# EAGLE design rx ok (EAGLE 9.6.2)
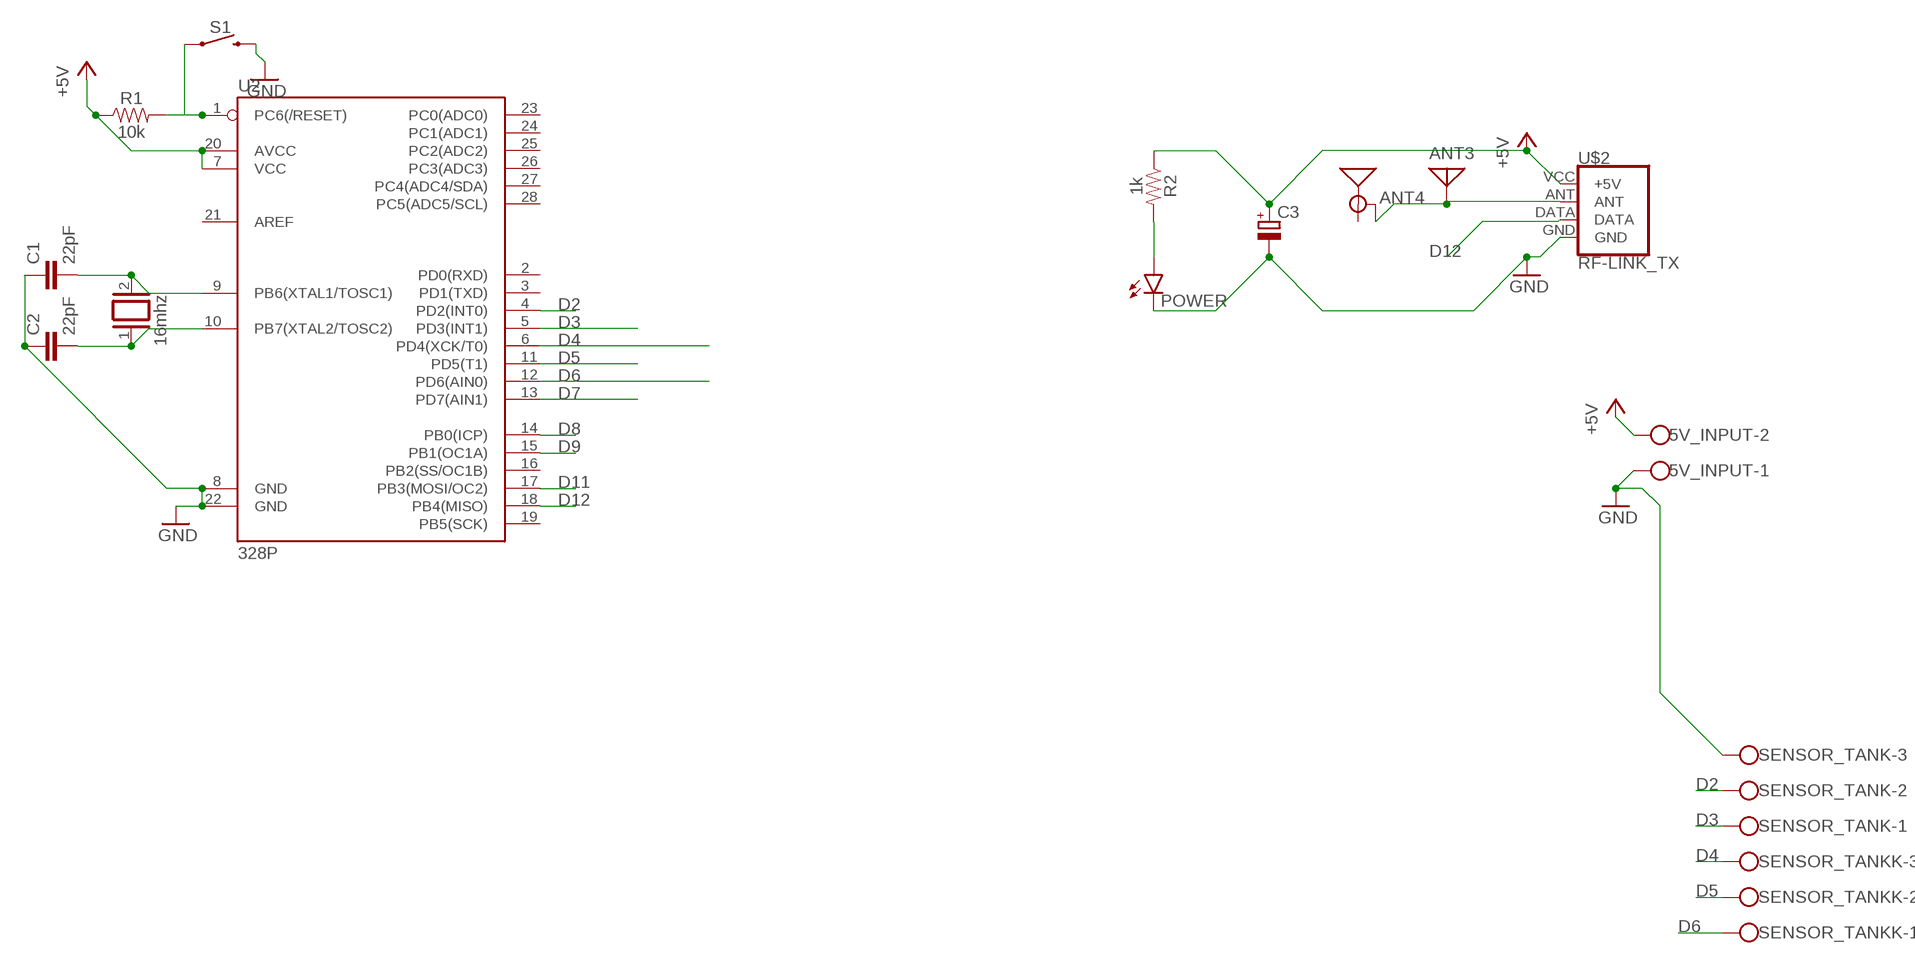
[diagram p0: schematic, sheet 1]

## Parts
5V_INPUT  W237-102  [W237-102]
ANT3  ANTENNA  [PAD-01]
ANT4  ANTENNA-GROUNDEDTRACE-15.2MM  [TRACE_ANTENNA_2.4GHZ_15.2MM]
C1  22pF  22PF-PTH-2.54MM-200V-5%  [CAP-PTH-2.54]
C2  22pF  22PF-PTH-2.54MM-200V-5%  [CAP-PTH-2.54]
C3  C-POL_RADIAL-20MM-DIA  [CAPPRD550W60D1200H2000B]
POWER  LED3MM  [LED3MM]
Q1  16mhz  XTAL/S  [QS]
R1  10k  1KOHM-HORIZ-1/4W-5%  [AXIAL-0.3]
R2  1k  1KOHM-HORIZ-1/4W-1%  [AXIAL-0.3]
S1  MOMENTARY-SWITCH-SPST-PTH-6.0MM  [TACTILE_SWITCH_PTH_6.0MM]
SENSOR_TANK  W237-103  [W237-103]
SENSOR_TANKK  W237-103  [W237-103]
U2  328P  ATMEGA328P_PDIP  [DIP28]
U$2  RF-LINK_TX  [RF-LINK_TX]

## Nets
+5V: 5V_INPUT.2 C3.1(+) R1.P$1 R2.P$1 U2.7(VCC) U2.20(AVCC) U$2.VCC(+5V)
D2: SENSOR_TANK.2 U2.4(PD2(INT0))
D3: SENSOR_TANK.1 U2.5(PD3(INT1))
D4: SENSOR_TANKK.3 U2.6(PD4(XCK/T0))
D5: SENSOR_TANKK.2 U2.11(PD5(T1))
D6: SENSOR_TANKK.1 U2.12(PD6(AIN0))
D7: U2.13(PD7(AIN1))
D8: U2.14(PB0(ICP))
D9: U2.15(PB1(OC1A))
D11: U2.17(PB3(MOSI/OC2))
D12: U2.18(PB4(MISO)) U$2.DATA
GND: 5V_INPUT.1 C1.1 C2.1 C3.2(-) POWER.K(C) S1.3 SENSOR_TANK.3 U2.8(GND) U2.22(GND) U$2.GND
N$1: R1.P$2 S1.1 U2.1(PC6(/RESET))
N$2: C1.2 Q1.2 U2.9(PB6(XTAL1/TOSC1))
N$3: C2.2 Q1.1 U2.10(PB7(XTAL2/TOSC2))
N$5: ANT3.1 ANT4.GND U$2.ANT
N$11: POWER.A R2.P$2
Unconnected: ANT4.ANT(SIGNAL) U2.2(PD0(RXD)) U2.3(PD1(TXD)) U2.16(PB2(SS/OC1B)) U2.19(PB5(SCK)) U2.21(AREF) U2.23(PC0(ADC0)) U2.24(PC1(ADC1)) U2.25(PC2(ADC2)) U2.26(PC3(ADC3)) U2.27(PC4(ADC4/SDA)) U2.28(PC5(ADC5/SCL))

## Library data of the parts
5V_INPUT = con-wago-500:W237-102: WAGO SCREW CLAMP; MPN: 237-102; OC_FARNELL: unknown; OC_NEWARK: 70K9898
ANT3 = discrete:ANTENNA: Antenna
ANT4 = SparkFun-RF:ANTENNA-GROUNDED: Antenna w/ Ground Connection 2.4GHz antennae with signal and ground terminals. TRACE_ANTENNA_2.4GHZ_15.2MM - Meander Trace antenna 15.2 x 5.7mm footprint Based on layout from TI app note AN043 <http://www.ti.com/lit/an/swra117d/swra117d.pdf>. TRACE_ANTENNA_2.4GHZ_25.7MM - Inverted F trace antenna 25.7 x 7.5 mm footprint. Based on layout from TI design note DN0007 <http://www.ti.com/lit/an/swru120b/swru120b.pdf>.
C1 C2 = SparkFun-Capacitors:22PF: 22pF ceramic capacitors A capacitor is a passive two-terminal electrical component used to store electrical energy temporarily in an electric field.; PROD_ID: CAP-09128
C3 = Capacitor:C-POL: Capacitor Polarised - Generic; CATEGORY: Capacitor
POWER = led:LED: LED OSRAM: - CHIPLED LG R971, LG N971, LY N971, LG Q971, LY Q971, LO R971, LY R971 LH N974, LH R974 LS Q976, LO Q976, LY Q976 LO Q996 - Hyper CHIPLED LW Q18S LB Q993, LB Q99A, LB R99A - SideLED LS A670, LO A670, LY A670, LG A670, LP A670 LB A673, LV A673, LT A673, LW A673 LH A674 LY A675 LS A676, LA A676, LO A676, LY A676, LW A676 LS A679, LY A679, LG A679 - Hyper Micro SIDELED® LS Y876, LA Y876, LO Y876, LY Y876 LT Y87S - SmartLED LW L88C, LW L88S LB L89C, LB L89S, LG L890 LS L89K, LO L89K, LY L89K LS L896, LA L896, LO L896, LY L896 - TOPLED LS T670, LO T670, LY T670, LG T670, LP T670 LSG T670, LSP T670, LSY T670, LOP T670, LYG T670 LG T671, LOG T671, LSG T671 LB T673, LV T673, LT T673, LW T673 LH T674 LS T676, LA T676, LO T676, LY T676, LB T676, LH T676, LSB T676, LW T676 LB T67C, LV T67C, LT T67C, LS T67K, LO T67K, LY T67K, LW E67C LS E67B, LA E67B, LO E67B, LY E67B, LB E67C, LV E67C, LT E67C LW T67C LS T679, LY T679, LG T679 LS T770, LO T770, LY T770, LG T770, LP T770 LB T773, LV T773, LT T773, LW T773 LH T774 LS E675, LA E675, LY E675, LS T675 LS T776, LA T776, LO T776, LY T776, LB T776 LHGB T686 LT T68C, LB T68C - Hyper Mini TOPLED® LB M676 - Mini TOPLED Santana® LG M470 LS M47K, LO M47K, LY M47K Source: http://www.osram.convergy.de LUXEON: - LUMILED® LXK2-PW12-R00, LXK2-PW12-S00, LXK2-PW14-U00, LXK2-PW14-V00 LXK2-PM12-R00, LXK2-PM12-S00, LXK2-PM14-U00 LXK2-PE12-Q00, LXK2-PE12-R00, LXK2-PE12-S00, LXK2-PE14-T00, LXK2-PE14-U00 LXK2-PB12-K00, LXK2-PB12-L00, LXK2-PB12-M00, LXK2-PB14-N00, LXK2-PB14-P00, LXK2-PB14-Q00 LXK2-PR12-L00, LXK2-PR12-M00, LXK2-PR14-Q00, LXK2-PR14-R00 LXK2-PD12-Q00, LXK2-PD12-R00, LXK2-PD12-S00 LXK2-PH12-R00, LXK2-PH12-S00 LXK2-PL12-P00, LXK2-PL12-Q00, LXK2-PL12-R00 Source: www.luxeon.com KINGBRIGHT: KA-3528ASYC Source: www.kingbright.com
Q1 = special:XTAL/S: CRYSTAL
R1 = SparkFun-Resistors:1KOHM: 1kΩ resistor A resistor is a passive two-terminal electrical component that implements electrical resistance as a circuit element. Resistors act to reduce current flow, and, at the same time, act to lower voltage levels within circuits. - Wikipedia; PROD_ID: RES-08380; VALUE: 1k
R2 = SparkFun-Resistors:1KOHM: 1kΩ resistor A resistor is a passive two-terminal electrical component that implements electrical resistance as a circuit element. Resistors act to reduce current flow, and, at the same time, act to lower voltage levels within circuits. - Wikipedia; PROD_ID: RES-12182
S1 = SparkFun-Switches:MOMENTARY-SWITCH-SPST: Momentary Switch (Pushbutton) - SPST Normally-open (NO) SPST momentary switches (buttons, pushbuttons). Variants PTH-12MM - 12mm square, through-hole Momentary Pushbutton Switch - 12mm Square <https://www.sparkfun.com/products/9190> (COM-09190) PTH-6.0MM, PTH-6.0MM-KIT - 6.0mm square, through-hole Mini Pushbutton Switch <https://www.sparkfun.com/products/97> (COM-00097) KIT package intended for soldering kit's - only one side of pads' copper is exposed. PTH-RIGHT-ANGLE-KIT - Right-angle, through-hole Right Angle Tactile Button <https://www.sparkfun.com/products/10791> - Used on SparkFun BigTime Watch Kit <https://www.sparkfun.com/products/11734> SMD-12MM - 12mm square, surface-mount Tactile Button - SMD (12mm) <https://www.sparkfun.com/products/12993> (COM-12993) Used on SparkFun PicoBoard <https://www.sparkfun.com/products/11888> SMD-4.5MM - 4.5mm Square Trackball Switch Used on SparkFun Blackberry Trackballer Breakout <https://www.sparkfun.com/products/13169> SMD-4.6MMX2.8MM - 4.60mm x 2.80mm, surface mount Used on SparkFun SAMD21 Mini Breakout <https://www.sparkfun.com/products/13664> SMD-5.2MM, SMD-5.2-REDUNDANT - 5.2mm square, surface-mount Mini Pushbutton Switch - SMD <https://www.sparkfun.com/products/8720> (COM-08720) Used on Arduino Pro Mini <https://www.sparkfun.com/products/11114> REDUNDANT package connects both switch circuits together SMD-6.0X3.5MM - 6.0 x 3.5mm, surface mount Momentary Reset Switch SMD <https://www.sparkfun.com/products/8229> (COM-08229) SMD-6.2MM-TALL - 6.2mm square, surface mount Tactile Button - SMD (6mm) <https://www.sparkfun.com/products/12992> Used on SparkFun Digital Sandbox <https://www.sparkfun.com/products/12651> SMD-RIGHT-ANGLE - Right-angle, surface mount Used on SparkFun Block for Intel® Edison - Arduino <https://www.sparkfun.com/products/13036>; PROD_ID: SWCH-08441; SF_SKU: COM-00097
SENSOR_TANK SENSOR_TANKK = con-wago-500:W237-103: WAGO SCREW CLAMP; MPN: 237-103; OC_FARNELL: unknown; OC_NEWARK: 18M7116
U2 = SparkFun-IC-Microcontroller:ATMEGA328P_PDIP: Atmel 328P Through hole ATMEGA328P uC used in the Arduino 32kb flash, 1k EEPROM, 2k SRAM Datasheet <http://www.sparkfun.com/datasheets/Components/SMD/ATMega328.pdf> SparkFun Products Storefront component: AVR 28 Pin 20MHz 32K 6A/D - ATMega328P <https://www.sparkfun.com/products/9061> (COM-09061) SparkFun Simon Says - Through-Hole Soldering Kit <https://www.sparkfun.com/products/10547> (KIT-10547) SparkFun Learn to Solder - Simon Says <https://www.sparkfun.com/products/13708> (KIT-13708) SparkFun BigTime Watch Kit <https://www.sparkfun.com/products/11734> (KIT-11734) SparkFun ClockIt <https://www.sparkfun.com/products/10930> (KIT-10930) SparkFun Serial Enabled LCD Kit <https://www.sparkfun.com/products/10097> (LCD-10097) SparkFun Simon Tilts - Through Hole Soldering Kit <https://www.sparkfun.com/products/12634> (KIT-12634) SparkFun Frequency Counter Kit <https://www.sparkfun.com/products/10140> (KIT-10140) FabFM Radio Kit <https://www.sparkfun.com/products/11043> (KIT-11043) SparkFun Binary Blaster Kit <https://www.sparkfun.com/products/12037> (KIT-12037) SparkFun Metro-Gnome <https://www.sparkfun.com/products/9236> (KIT-09236) ATmega328 with Arduino Optiboot (Uno) <https://www.sparkfun.com/products/10524> (DEV-10524); PROD_ID: IC-09136
U$2 = SparkFun-RF:RF-LINK_TX: RF Link Transmitter (434 MHz, 315 MHz) These wireless transmitters work with equivalent receivers. They can easily fit into a breadboard and work well with microcontrollers to create a very simple wireless data link. Since these are only transmitters, they will only work communicating data one-way, you would need two pairs (of different frequencies) to act as a transmitter/receiver pair. SparkFun Products RF Link Transmitter - 434MHz <https://www.sparkfun.com/products/10534> (WRL-10534); SF_ID: WRL-10534

## Net classes
0 default: width 0.711 mm, clearance 0.457 mm

## Board
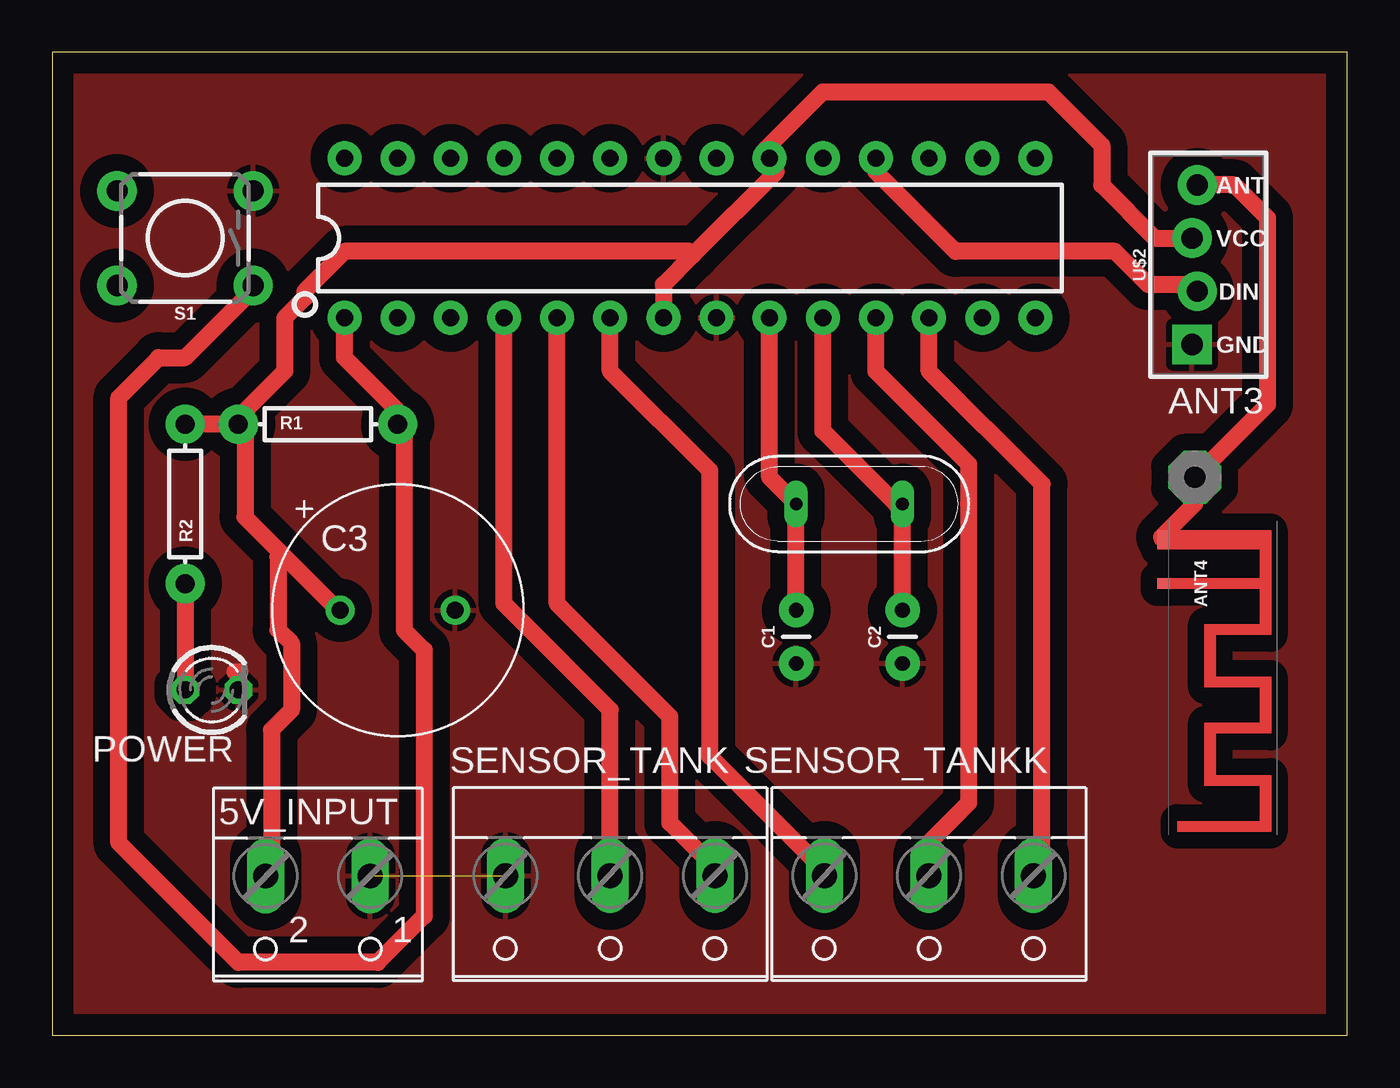
[diagram p1: board, top side]

Size 61.9 x 46.98 mm. Coordinates in mm from the lower left corner, seen from the top.
Outline: 0,0 61.9,0 61.9,46.98 0,46.98 0,0
Copper layers (1*16): Top 0.035mm / dielectric 1.5mm / Bottom 0.035mm
Design rules "default *": minimum track width 32mil, minimum drill 0.35mm, track to track 32mil, track to pad 32mil, pad to pad 32mil, via to via 32mil, smd to smd 6mil, copper to edge 40mil, drill to drill 6mil, minimum pad ring 10mil, minimum via ring 8mil, stop-mask expansion 4mil, vias tented up to drill 0mil, thermal gap 12mil

### Footprints (pad centres in the part's own frame; a part is rotated, then mirrored left to right if it is on the bottom)
W237-102 = drill 1.194 long: 1 -2.5,-1.27; 2 2.5,-1.27
PAD-01 = drill 1.321 pad 2.54 octagon: 1 0,0
TRACE_ANTENNA_2.4GHZ_15.2MM = smd 0.5 x 0.5: ANT 0,-0.25 | smd 0.9 x 0.5: GND -2.1,-0.25
CAP-PTH-2.54 = drill 0.7 pad 1.651: 1 -1.27,0; 2 1.27,0
CAPPRD550W60D1200H2000B = drill 0.8 pad 1.4: 1 -2.75,0; 2 2.75,0
LED3MM = drill 0.813 octagon: A -1.27,0; K 1.27,0
QS = drill 0.61 long: 1 -2.54,0; 2 2.54,0
AXIAL-0.3 = drill 0.9 pad 1.88: P$1 -3.81,0; P$2 3.81,0
TACTILE_SWITCH_PTH_6.0MM = drill 1.016 pad 1.88: 1 -3.251,2.261; 2 3.251,2.261; 3 -3.251,-2.261; 4 3.251,-2.261
W237-103 = drill 1.194 long: 1 -5,-1.29; 2 0,-1.29; 3 5,-1.29
DIP28 = drill 0.813 pad 1.626: 1 -16.51,-3.81; 2 -13.97,-3.81; 3 -11.43,-3.81; 4 -8.89,-3.81; 5 -6.35,-3.81; 6 -3.81,-3.81; 7 -1.27,-3.81; 8 1.27,-3.81; 9 3.81,-3.81; 10 6.35,-3.81; 11 8.89,-3.81; 12 11.43,-3.81; 13 13.97,-3.81; 14 16.51,-3.81; 15 16.51,3.81; 16 13.97,3.81; 17 11.43,3.81; 18 8.89,3.81; 19 6.35,3.81; 20 3.81,3.81; 21 1.27,3.81; 22 -1.27,3.81; 23 -3.81,3.81; 24 -6.35,3.81; 25 -8.89,3.81; 26 -11.43,3.81; 27 -13.97,3.81; 28 -16.51,3.81
RF-LINK_TX = drill 1.016 pad 1.88: ANT 3.81,-0.127; DATA -1.27,-0.127; VCC 1.27,0.127 | drill 1.016 pad 1.88 square: GND -3.81,0.127

### Placement (x,y rotation side)
5V_INPUT  12.7,6.35 180 top
ANT3  54.61,26.67 0 top
ANT4  53.34,21.59 270 top
C1  35.56,19.05 90 top
C2  40.64,19.05 90 top
C3  16.51,20.32 0 top
POWER  7.62,16.51 0 top
Q1  38.1,25.4 180 top
R1  12.7,29.21 0 top
R2  6.35,25.4 270 top
S1  6.35,38.1 180 top
SENSOR_TANK  26.67,6.35 180 top
SENSOR_TANKK  41.91,6.35 180 top
U2  30.48,38.1 0 top
U$2  54.61,36.83 90 top

### Tracks (layer width: path | path; a pad name or v marks a point on that pad's centre or on a via)
+5V
  Top 0.813: 10.95,23.02 9.21,24.76 9.21,28.89 R1.P$1 | 10.95,23.02 13.65,20.32 C3.1 | 5V_INPUT.2 10.48,7.62 10.48,14.6 11.43,15.56 11.43,18.73 10.8,19.37 10.8,22.86 10.95,23.02 | R1.P$1 R2.P$1 | U2.7 29.21,35.88 30.64,37.31 | 30.64,37.31 34.61,41.27 34.29,41.59 U2.20 33.97,41.91 33.97,42.23 36.83,45.09 47.63,45.09 50.16,42.54 50.16,40.64 52.71,38.1 U$2.VCC | R1.P$1 8.89,29.53 11.11,31.75 11.11,34.29 12.07,35.24 12.07,35.56 13.97,37.46 30.48,37.46 30.64,37.31
D2
  Top 0.813: U2.4 21.59,20.64 26.67,15.56 SENSOR_TANK.2
D3
  Top 0.813: U2.5 24.13,20.64 29.53,15.24 29.53,10.16 31.75,7.94 SENSOR_TANK.1
D4
  Top 0.813: U2.6 26.67,31.75 31.43,26.99 31.43,13.33 36.83,7.94 SENSOR_TANKK.3
D5
  Top 0.813: U2.11 39.37,31.75 43.82,27.3 43.82,11.11 41.91,9.21 SENSOR_TANKK.2
D6
  Top 0.813: U2.12 41.91,31.75 47.31,26.35 47.31,8.25 46.99,7.94 SENSOR_TANKK.1
D12
  Top 0.813: U2.18 39.37,41.27 43.18,37.46 50.8,37.46 52.39,35.88 54.61,35.88 54.93,35.56 U$2.DATA
GND  (1 unrouted)
  Top 0.813: 8.74,17.37 8.97,17.37 | 8.89,17.14 POWER.K
  pour Top: 0,46.99 0,0 62.23,0 62.23,46.99
N$1
  Top 0.813: U2.1 13.97,32.38 16.51,29.84 R1.P$2 16.83,29.21 16.83,19.37 17.78,18.41 17.78,5.71 15.56,3.49 8.89,3.49 3.18,9.21 3.18,30.48 5.08,32.38 6.35,32.38 9.52,35.56 S1.1
N$2
  Top 0.813: C1.2 Q1.2 34.29,26.67 U2.9
N$3
  Top 0.813: C2.2 Q1.1 40.32,25.4 36.83,28.89 U2.10
N$5
  Top 0.813: U$2.ANT 56.52,40.64 58.1,39.05 58.1,30.16 ANT3.1 54.61,25.4 53.02,23.81 ANT4.GND
N$11
  Top 0.813: R2.P$2 POWER.A